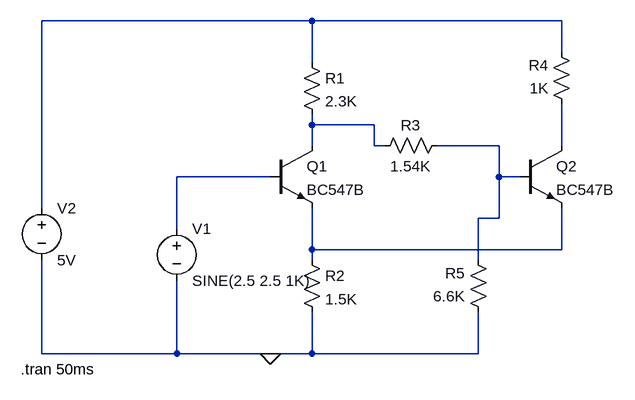
[diagram p0: schematic EXPT 9.asc]
EXPT 9.asc, the LTspice schematic file:
Version 4.1
SHEET 1 880 680
WIRE 208 -64 -208 -64
WIRE 592 -64 208 -64
WIRE 592 -16 592 -64
WIRE 208 0 208 -64
WIRE 208 96 208 80
WIRE 304 96 208 96
WIRE 208 128 208 96
WIRE 304 128 304 96
WIRE 320 128 304 128
WIRE 496 128 400 128
WIRE 592 128 592 64
WIRE 144 176 0 176
WIRE 496 176 496 128
WIRE 528 176 496 176
WIRE -208 224 -208 -64
WIRE 496 240 496 176
WIRE 496 240 464 240
WIRE 0 256 0 176
WIRE 208 288 208 224
WIRE 592 288 592 224
WIRE 592 288 208 288
WIRE 208 304 208 288
WIRE 464 304 464 240
WIRE -208 448 -208 304
WIRE 0 448 0 336
WIRE 0 448 -208 448
WIRE 144 448 0 448
WIRE 208 448 208 384
WIRE 208 448 144 448
WIRE 464 448 464 384
WIRE 464 448 208 448
FLAG 144 448 0
SYMBOL npn 144 128 R0
SYMATTR InstName Q1
SYMATTR Value BC547B
SYMBOL npn 528 128 R0
SYMATTR InstName Q2
SYMATTR Value BC547B
SYMBOL res 192 -16 R0
SYMATTR InstName R1
SYMATTR Value 2.3K
SYMBOL res 192 288 R0
SYMATTR InstName R2
SYMATTR Value 1.5K
SYMBOL res 416 112 R90
WINDOW 0 0 56 VBottom 2
WINDOW 3 32 56 VTop 2
SYMATTR InstName R3
SYMATTR Value 1.54K
SYMBOL res 608 80 R180
WINDOW 0 36 76 Left 2
WINDOW 3 36 40 Left 2
SYMATTR InstName R4
SYMATTR Value 1K
SYMBOL res 480 400 R180
WINDOW 0 36 76 Left 2
WINDOW 3 36 40 Left 2
SYMATTR InstName R5
SYMATTR Value 6.6K
SYMBOL voltage 0 240 R0
WINDOW 123 0 0 Left 0
WINDOW 39 0 0 Left 0
SYMATTR InstName V1
SYMATTR Value SINE(2.5 2.5 1K)
SYMBOL voltage -208 208 R0
WINDOW 123 0 0 Left 0
WINDOW 39 0 0 Left 0
SYMATTR InstName V2
SYMATTR Value 5V
TEXT -240 472 Left 2 !.tran 50ms

The netlist it stands for:
* EXPT 9.asc
Q1 N002 N005 N006 0 BC547B
Q2 N004 N003 N006 0 BC547B
R1 N001 N002 2.3K
R2 N006 0 1.5K
R3 N003 N002 1.54K
R4 N004 N001 1K
R5 0 N003 6.6K
V1 N005 0 SINE(2.5 2.5 1K)
V2 N001 0 5V
.model NPN NPN
.model PNP PNP
.lib standard.bjt
.tran 50ms
.backanno
.end